# EAGLE design flap_controller (EAGLE 9.7.0)
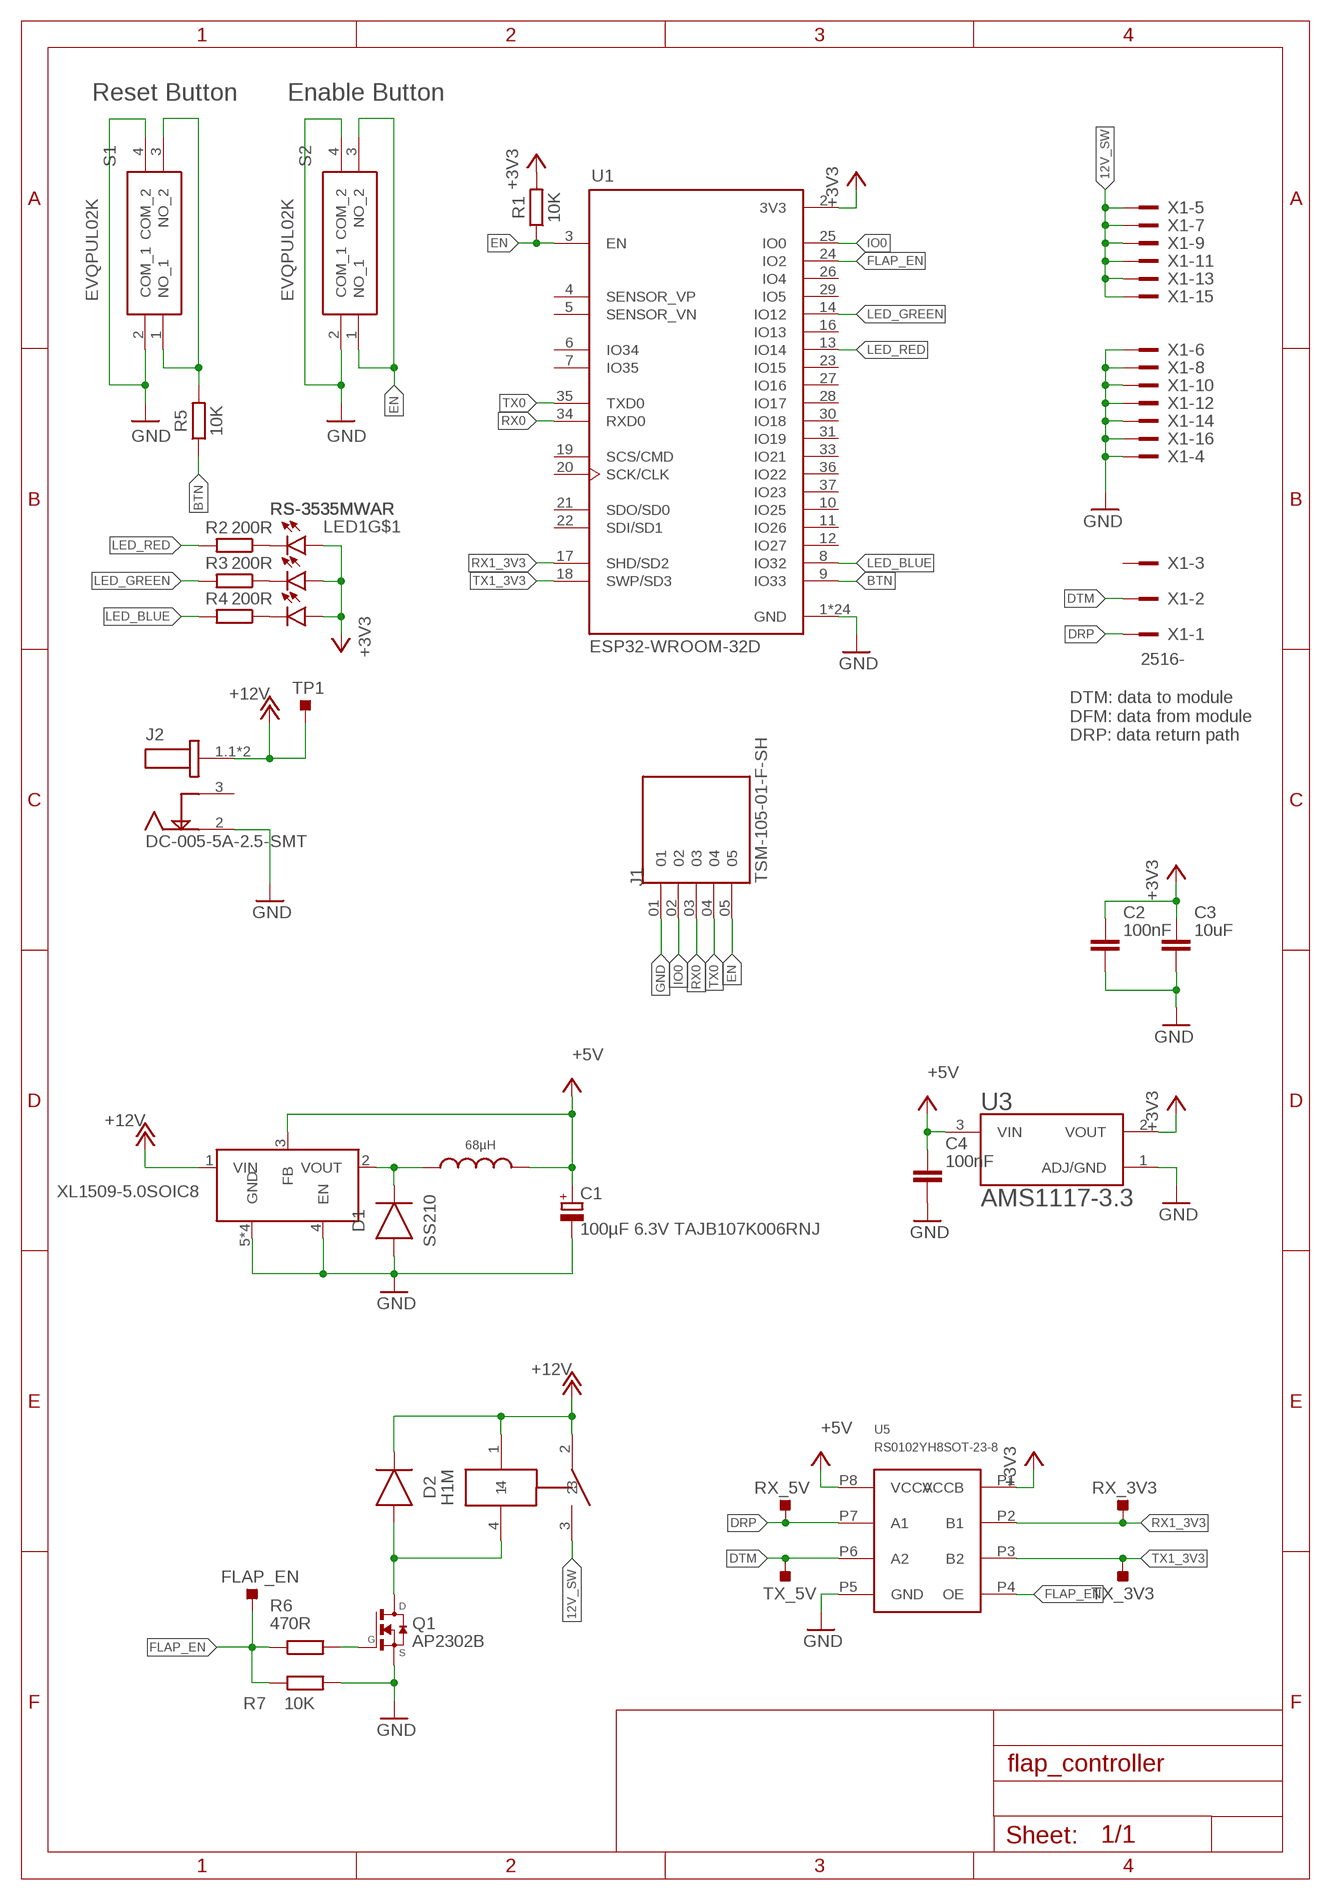
[diagram p0: schematic, sheet 1]

## Parts
C1  100µF 6.3V TAJB107K006RNJ  C-POL_TANTALUM-1411(3528-METRIC)  [CAPMP3528X210N]
C2  100nF  C_CHIP-0805(2012-METRIC)  [CAPC2012X110]
C3  10uF  C_CHIP-0805(2012-METRIC)  [CAPC2012X110]
C4  100nF  C_CHIP-0805(2012-METRIC)  [CAPC2012X110]
D1  SS210  DIODEDO-214AC(SMA)  [DIOM5226X290N]
D2  H1M  DIODE_DO-219-AB(SOD123F)  [SODFL3718X115]
FLAP_EN  TESTPOINT_TPS-PAD-036  [TESTPOINT_PAD-036]
J1  TSM-105-01-F-SH  [SAMTEC_TSM-105-01-F-SH]
J2  DC-005-5A-2.5-SMT  DCJ200-05-A-XX-X_REVA  [GCT_DCJ200-05-A-XX-X_REVA]
K1  G5NB-1A-E DC12  G5NB-1A-EDC12  [G5NB-1A-EDC12]
L1  SWPA6045S680MT  LVS606028-100M-N  [LVS606028-100M-N]
LED1  RS-3535MWAR  [RS-3535MWAR]
Q1  AP2302B  TRANSISTOR-FET_DMN2004K  [TRANSISTOR-FET_SOT23]
R1  10K  R_CHIP-0805(2012-METRIC)  [RESC2012X65]
R2  200R  R_CHIP-0805(2012-METRIC)  [RESC2012X65]
R3  200R  R_CHIP-0805(2012-METRIC)  [RESC2012X65]
R4  200R  R_CHIP-0805(2012-METRIC)  [RESC2012X65]
R5  10K  R_CHIP-0805(2012-METRIC)  [RESC2012X65]
R6  470R  R_CHIP-0805(2012-METRIC)  [RESC2012X65]
R7  10K  R_CHIP-0805(2012-METRIC)  [RESC2012X65]
RX_3V3  TESTPOINT_TPS-PAD-036  [TESTPOINT_PAD-036]
RX_5V  TESTPOINT_TPS-PAD-036  [TESTPOINT_PAD-036]
S1  EVQPUL02K  [EVQPUL02K]
S2  EVQPUL02K  [EVQPUL02K]
TP1  TESTPOINT_TPS-SMD-10SN  [TESTPOINT_SMD-10SN]
TX_3V3  TESTPOINT_TPS-PAD-036  [TESTPOINT_PAD-036]
TX_5V  TESTPOINT_TPS-PAD-036  [TESTPOINT_PAD-036]
U1  ESP32-WROOM-32D  [MODULE_ESP32-WROOM-32D]
U2  XL1509-5.0SOIC8  [SOIC8]
U3  AMS1117-3.3  [SOT229P700X180-4N]
U5  RS0102YH8SOT-23-8  [SOT-23-8]
X1  2516-  [PAK100/2500-16]

## Nets
12V_SW: K1.3 X1.5 X1.7 X1.9 X1.11 X1.13 X1.15
+3V3: C2.1 C3.1 LED1.B_A(A) LED1.G_A(A) LED1.R_A(A) R1.2 U1.2(3V3) U3.2(VOUT) U5.P1(VCCB)
+5V: C1.1(+) C4.1 L1.P$2 U2.3(FB) U3.3(VIN) U5.P8(VCCA)
+12V: D2.1(C) J2.1.1 J2.1.2 K1.1 K1.2 TP1.TP U2.1(VIN)
BTN: R5.1 U1.9(IO33)
DRP: RX_5V.1(TP) U5.P7(A1) X1.1
DTM: TX_5V.1(TP) U5.P6(A2) X1.2
EN: J1.05 R1.1 S2.1(NO_1) S2.3(NO_2) U1.3(EN)
FLAP_EN: FLAP_EN.1(TP) R6.1 R7.1 U1.24(IO2) U5.P4(OE)
GND: C1.2(-) C2.2 C3.2 C4.2 D1.2(A) J1.01 J2.2 Q1.2(S) R7.2 S1.2(COM_1) S1.4(COM_2) S2.2(COM_1) S2.4(COM_2) U1.1(GND) U1.15(GND) U1.38(GND) U1.39_1(GND) U1.39_2(GND) U1.39_3(GND) U1.39_4(GND) U1.39_5(GND) U1.39_6(GND) U1.39_7(GND) U1.39_8(GND) U1.39_9(GND) U1.39_10(GND) U1.39_11(GND) U1.39_12(GND) U1.39_13(GND) U1.39_14(GND) U1.39_15(GND) U1.39_16(GND) U1.39_17(GND) U1.39_18(GND) U1.39_19(GND) U1.39_20(GND) U1.39_21(GND) U2.4(EN) U2.5(GND) U2.6(GND) U2.7(GND) U2.8(GND) U3.1(ADJ/GND) U5.P5(GND) X1.4 X1.6 X1.8 X1.10 X1.12 X1.14 X1.16
IO0: J1.02 U1.25(IO0)
LED_BLUE: R4.2 U1.8(IO32)
LED_GREEN: R3.2 U1.14(IO12)
LED_RED: R2.2 U1.13(IO14)
N$2: D1.1(C) L1.P$1 U2.2(VOUT)
N$3: LED1.B_K(C) R2.1
N$4: LED1.G_K(C) R3.1
N$5: LED1.R_K(C) R4.1
N$7: D2.2(A) K1.4 Q1.3(D)
N$8: Q1.1(G) R6.2
N$22: R5.2 S1.1(NO_1) S1.3(NO_2)
RX0: J1.03 U1.34(RXD0)
RX1_3V3: RX_3V3.1(TP) U1.17(SHD/SD2) U5.P2(B1)
TX0: J1.04 U1.35(TXD0)
TX1_3V3: TX_3V3.1(TP) U1.18(SWP/SD3) U5.P3(B2)
Unconnected: J2.3 U1.4(SENSOR_VP) U1.5(SENSOR_VN) U1.6(IO34) U1.7(IO35) U1.10(IO25) U1.11(IO26) U1.12(IO27) U1.16(IO13) U1.19(SCS/CMD) U1.20(SCK/CLK) U1.21(SDO/SD0) U1.22(SDI/SD1) U1.23(IO15) U1.26(IO4) U1.27(IO16) U1.28(IO17) U1.29(IO5) U1.30(IO18) U1.31(IO19) U1.33(IO21) U1.36(IO22) U1.37(IO23) X1.3

## Notes on the sheet
- Reset Button | Enable Button
- DTM: data to module
  DFM: data from module
  DRP: data return path
- 68µH

## Library data of the parts
C1 = Capacitor:C-POL: Capacitor Polarised - Generic; CATEGORY: Capacitor
C2-C4 = Capacitor:C: Capacitor - Generic; CATEGORY: Capacitor
D1 D2 = Diode:DIODE: Diode Rectifier - Generic; CATEGORY: Diode; SUB-CATEGORY: Rectifier; VALUE: DIODE
FLAP_EN RX_3V3 RX_5V TP1 TX_3V3 TX_5V = 52101-101-REV-A_v16:TESTPOINT_TPS: TEST POINT PAD; BOM: EXCLUDE
J1 = TSM-105-01-F-SH:TSM-105-01-F-SH; MANUFACTURER: Samtec; PARTREV: R; STANDARD: Manufacturer Recommendations
J2 = DCJ200-05-A-XX-X_REVA:DCJ200-05-A-XX-X_REVA: DC Power Jack, SMT, Horizontal, with Locating Pegs, D2.0mm; MANUFACTURER: GCT
K1 = TPMP1470GJ-Z:G5NB-1A-EDC12
L1 = TPMP1470GJ-Z:LVS606028-100M-N
LED1 = TPMP1470GJ-Z:RS-3535MWAR
Q1 = 52101-101-REV-A_v16:TRANSISTOR-FET_DMN2004K: N-Channel Enhancement MOSFET
R1-R7 = Resistor:R: Resistor Fixed - Generic; CATEGORY: Resistor; SUB-CATEGORY: Fixed
S1 S2 = SamacSys_Parts:EVQPUL02K: Black Tactile Switch, Single Pole Single Throw (SPST) 50 mA @ 12 V ac 1.65mm Source: Datasheet <https://www3.panasonic.biz/ac/e_download/control/switch/light-touch/catalog/sw_lt_eng_smalls_side.pdf?f_cd=402910&via=ok>; DESCRIPTION: Black Tactile Switch, Single Pole Single Throw (SPST) 50 mA @ 12 V ac 1.65mm; HEIGHT: 1.95mm; MANUFACTURER_NAME: Panasonic; MANUFACTURER_PART_NUMBER: EVQPUL02K
U1 = ESP32-WROOM-32D:ESP32-WROOM-32D: Bluetooth, WiFi 802.11b/g/n, Bluetooth v4.2 + EDR, Class 1, 2 and 3 Transceiver Module 2.4GHz ~ 2.5GHz Integrated, Trace Surface Mount Check prices <https://pricing.snapeda.com/parts/ESP32-WROOM-32D/Espressif%20Systems/view-part?ref=eda>; AVAILABILITY: Bad; DESCRIPTION: Bluetooth, WiFi 802.11b/g/n, Bluetooth v4.2 +EDR, Class 1, 2 and 3 Transceiver Module 2.4GHz ~ 2.5GHz Integrated, Trace Surface Mount; MF: Espressif Systems; MP: ESP32-WROOM-32D; PACKAGE: Module Espressif Systems; PRICE: None
U2 = TPMP1470GJ-Z:XL1509-5.0
U3 = AMS1117-3.3:AMS1117-3.3: Sot223/Pkg 1-Amp 3.3-Volt Low Drop Out Voltage Regulatator; AVAILABILITY: Unavailable; MANUFACTURER: Advanced Mololithic Systems; MP: AMS1117-3.3; PACKAGE: SOT-223 ams; PARTREV: NA; PRICE: None; STANDARD: IPC-7351B
U5 = TPMP1470GJ-Z:RS0102YH8
X1 = con-3m:2516-: 3M (TM) Pak 100 4-Wall Header Source: 3M; OC_FARNELL: unknown; OC_NEWARK: unknown

## Board
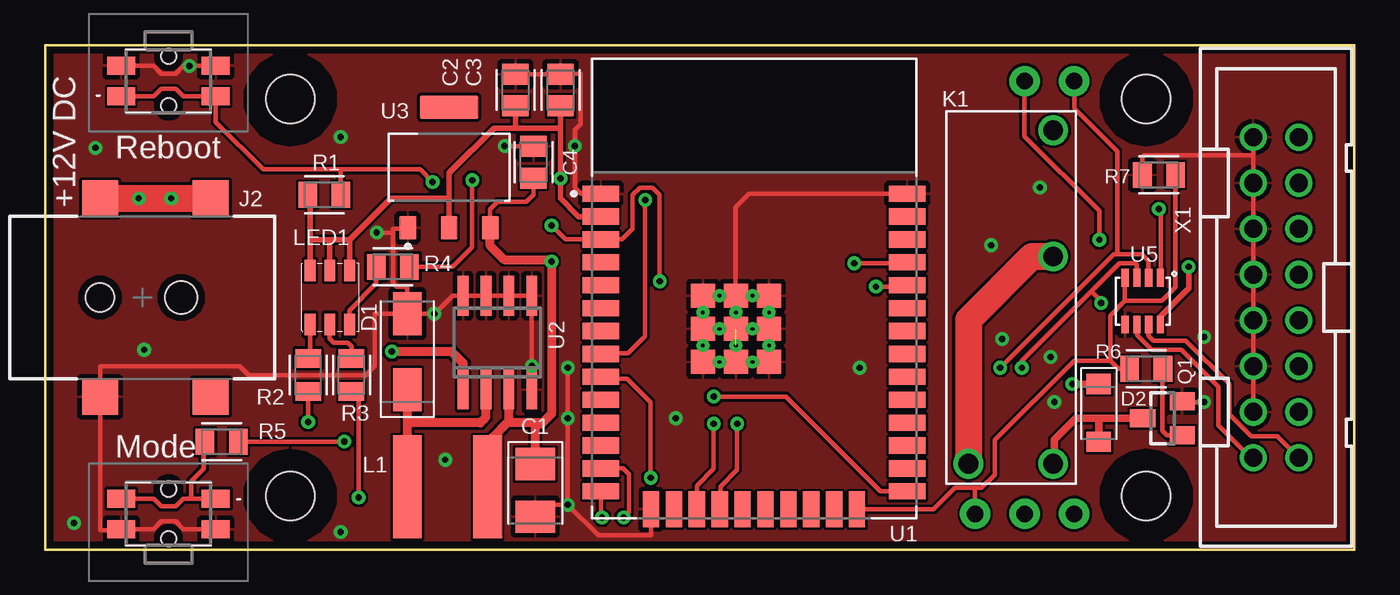
[diagram p1: board, top side]
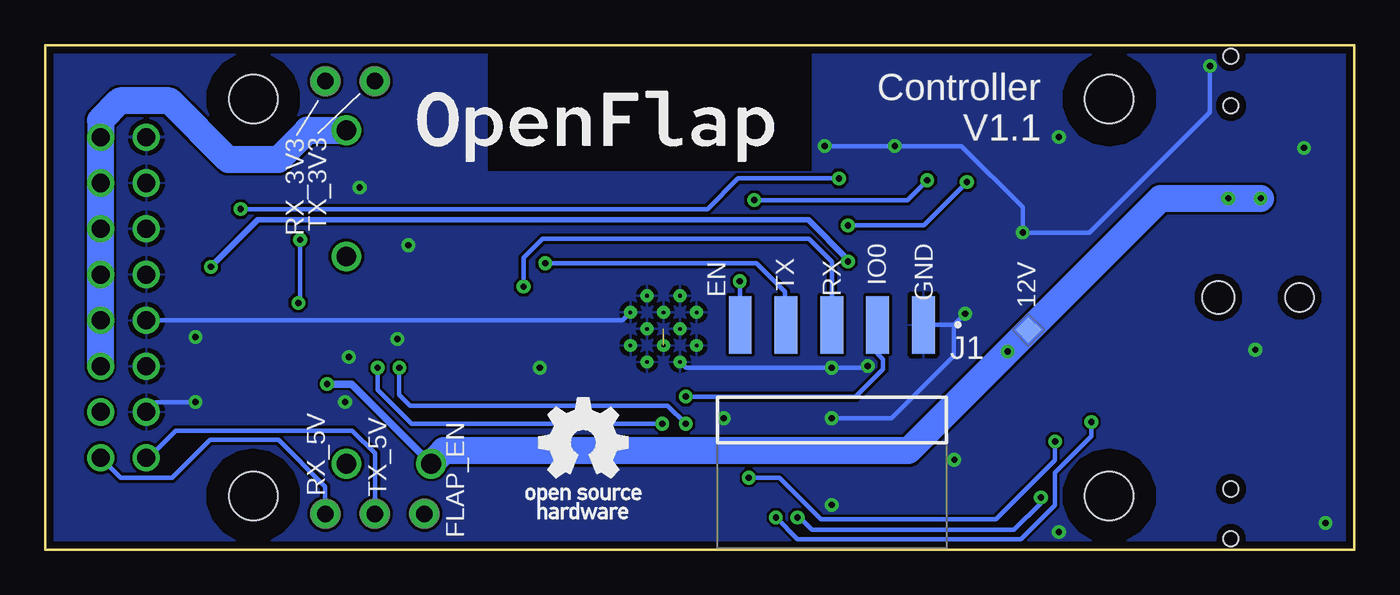
[diagram p2: board, bottom side, seen from below]

Size 72.65 x 28 mm. Coordinates in mm from the lower left corner, seen from the top.
Outline: 0,28 72.65,28 72.65,0 0,0 0,28
Copper layers (1*16): Top / Bottom
Stack-up Default Layer Stack: Top User Defined 0.035mm / Dielectric-1 User Defined 1.5mm / Bottom User Defined 0.035mm
Design rules "default *": minimum track width 6mil, minimum drill 0.35mm, track to track 6mil, track to pad 6mil, pad to pad 6mil, via to via 6mil, smd to smd 6mil, copper to edge 0.4mm, drill to drill 6mil, minimum pad ring 10mil, minimum via ring 8mil, stop-mask expansion 4mil, vias tented up to drill 0mil, thermal gap 10mil
Holes 2.7 mm at 13.6,25 13.6,3 61.1,3 61.1,25
tRestrict: area 11.6,23 to 15.6,27; area 11.6,1 to 15.6,5; area 59.1,1 to 63.1,5; area 59.1,23 to 63.1,27
bRestrict: area 11.6,23 to 15.6,27; area 11.6,1 to 15.6,5; area 59.1,1 to 63.1,5; area 59.1,23 to 63.1,27; area 30.1,21 to 48.1,28.5

### Footprints (pad centres in the part's own frame; a part is rotated, then mirrored left to right if it is on the bottom)
CAPMP3528X210N = smd 1.796 x 2.204: 1 -1.46,0; 2 1.46,0
CAPC2012X110 = smd 1.165 x 1.465: 1 -0.875,0; 2 0.875,0
DIOM5226X290N = smd 2.392 x 1.565: 1 -2.108,0; 2 2.108,0
SODFL3718X115 = smd 1.115 x 1.361: 1 -1.6,0; 2 1.6,0
TESTPOINT_PAD-036 = drill 0.914 pad 1.676: 1 0,0
SAMTEC_TSM-105-01-F-SH = smd 1.27 x 3.18: 01 -5.08,-5.28; 02 -2.54,-5.28; 03 0,-5.28; 04 2.54,-5.28; 05 5.08,-5.28
GCT_DCJ200-05-A-XX-X_REVA = smd 2 x 2: 1.1 -5.5,3.8; 1.2 -5.5,-2.35; 2 5.5,-2.35; 3 5.5,3.8 | hole 1.8: 0,2.15 | hole 1.6: 0,-2.35
G5NB-1A-EDC12 = drill 1.1: 1 -9.222,2.368; 2 2.278,-2.332; 3 9.278,-2.332; 4 -9.222,-2.332
LVS606028-100M-N = smd 5.7 x 1.6: P$1 0,-2.2; P$2 0,2.25
RS-3535MWAR = smd 1.2 x 0.6: B_A -1.5,-1.1; B_K 1.5,-1.1; G_A -1.5,0; G_K 1.5,0; R_A -1.5,1.1; R_K 1.5,1.1
TRANSISTOR-FET_SOT23 = smd 1 x 1.4: 1 -0.95,-1.1; 2 0.95,-1.1; 3 0,1.1
RESC2012X65 = smd 1.031 x 1.42: 1 -0.919,0; 2 0.919,0
EVQPUL02K = smd 1.55 x 1: 1 2.625,0.85; 2 2.625,-0.85; 3 -2.625,0.85; 4 -2.625,-0.85 | hole 0.85: 0,-1.375; 0,1.375
TESTPOINT_SMD-10SN = smd 1 x 1: TP 0,0
MODULE_ESP32-WROOM-32D = smd 2 x 0.9: 1 -8.5,5.26; 2 -8.5,3.99; 3 -8.5,2.72; 4 -8.5,1.45; 5 -8.5,0.18; 6 -8.5,-1.09; 7 -8.5,-2.36; 8 -8.5,-3.63; 9 -8.5,-4.9; 10 -8.5,-6.17; 11 -8.5,-7.44; 12 -8.5,-8.71; 13 -8.5,-9.98; 14 -8.5,-11.25; 25 8.5,-11.25; 26 8.5,-9.98; 27 8.5,-8.71; 28 8.5,-7.44; 29 8.5,-6.17; 30 8.5,-4.9; 31 8.5,-3.63; 32 8.5,-2.36; 33 8.5,-1.09; 34 8.5,0.18; 35 8.5,1.45; 36 8.5,2.72; 37 8.5,3.99; 38 8.5,5.26 | smd 0.9 x 2: 15 -5.715,-12.25; 16 -4.445,-12.25; 17 -3.175,-12.25; 18 -1.905,-12.25; 19 -0.635,-12.25; 20 0.635,-12.25; 21 1.905,-12.25; 22 3.175,-12.25; 23 4.445,-12.25; 24 5.715,-12.25 | smd 1.33 x 1.33: 39_1 -2.835,-0.405; 39_2 -1,-0.405; 39_3 0.835,-0.405; 39_4 -2.835,-2.24; 39_5 -1,-2.24; 39_6 0.835,-2.24; 39_7 -2.835,-4.075; 39_8 -1,-4.075; 39_9 0.835,-4.075 | drill 0.2 pad 0.3: 39_10 -1.917,-0.405; 39_11 -0.083,-0.405; 39_12 -2.835,-1.323; 39_13 -1,-1.323; 39_14 0.835,-1.323; 39_15 -1.917,-2.24; 39_16 -0.083,-2.24; 39_17 -2.835,-3.158; 39_18 -1,-3.158; 39_19 0.835,-3.158; 39_20 -1.917,-4.075; 39_21 -0.083,-4.075
SOIC8 = smd 0.6 x 2.2: 1 -1.905,-2.6; 2 -0.635,-2.6; 3 0.635,-2.6; 4 1.905,-2.6; 5 1.905,2.6; 6 0.635,2.6; 7 -0.635,2.6; 8 -1.905,2.6
SOT229P700X180-4N = smd 0.93 x 1.31: 1 -2.29,-3.345; 2 0,-3.345; 3 2.29,-3.345 | smd 3.24 x 1.31: 4 0,3.345
SOT-23-8 = smd 0.4 x 0.99: P1 -0.975,-1.3; P2 -0.325,-1.3; P3 0.325,-1.3; P4 0.975,-1.3; P5 0.975,1.3; P6 0.325,1.3; P7 -0.325,1.3; P8 -0.975,1.3
PAK100/2500-16 = drill 1 pad 1.422: 1 -8.89,-1.27; 2 -8.89,1.27; 3 -6.35,-1.27; 4 -6.35,1.27; 5 -3.81,-1.27; 6 -3.81,1.27; 7 -1.27,-1.27; 8 -1.27,1.27; 9 1.27,-1.27; 10 1.27,1.27; 11 3.81,-1.27; 12 3.81,1.27; 13 6.35,-1.27; 14 6.35,1.27; 15 8.89,-1.27; 16 8.89,1.27

### Placement (x,y rotation side)
C1  27.2,3.3 270 top
C2  26.1,25.5 90 top
C3  28.6,25.5 90 top
C4  27.1,21.5 90 top
D1  20.1,11 90 top
D2  58.47,7.6 270 top
FLAP_EN  51.6,2 0 bottom
J1  29,7.2 180 bottom
J2  5.4,14 270 top
K1  53.6,14 90 top
L1  22.3,3.5 270 top
LED1  15.8,14 270 top
Q1  62,7.3 90 top
R1  15.5,19.7 180 top
R2  14.6,9.7 270 top
R3  17,9.7 270 top
R4  19.3,15.7 0 top
R5  9.8,6 180 top
R6  61.1,10.05 0 top
R7  61.8,20.8 180 top
RX_3V3  57.1,26 0 bottom
RX_5V  57.1,2 0 bottom
S1  6.85,2 0 top
S2  6.85,26 180 top
TP1  18.08,12.2 315 bottom
TX_3V3  54.35,26 0 bottom
TX_5V  54.35,2 0 bottom
U1  39.34,14.5 0 top
U2  25.1,11.5 0 top
U3  22.41,21.22 0 top
U5  60.9,13.8 180 top
X1  68.3,14 90 top

### Tracks (layer width: path | path; a pad name or v marks a point on that pad's centre or on a via)
12V_SW
  Bottom 1.5: K1.3 58.08,23.28 59.71,21.65 62.49,21.65 65.74,24.9 68.5,24.9 69.57,23.83 X1.15 X1.13 X1.11 X1.9 X1.7 X1.5
+3V3  (via drill 0.35)
  Top 0.254: 30.3,18.49 U1.2 | 28.6,20.4 v28.6,20.6 | v61.8,18.9 61.9,18.8 61.9,15.12 U5.P1
  Top 0.305: 22.41,19.5 U3.2 | 22.41,19.5 22.41,20.91 24.9,23.4 26.1,23.4 | C3.1 28.6,23.4 | v28.6,20.6 28.6,23.4 | 28.6,20.4 28.6,19.5 29.61,18.49 30.3,18.49 | C2.1 26.1,23.4 | 26.1,23.4 28.6,23.4 | 22.41,19.5 19.2,19.5 16.9,17.2 | 16.9,17.2 15.8,17.2 | 15.8,17.2 14.7,17.2 | LED1.G_A 15.8,17.2 | LED1.B_A 14.7,17.2 | LED1.R_A 16.9,17.2 | R1.2 14.7,19.58 14.7,17.2
  Bottom 0.254: v28.6,20.6 34.2,20.6 35.9,18.9 v61.8,18.9
+5V  (via drill 0.35)
  Top 0.254: U3.3 24.7,18.9 25.1,19.3 26.7,19.3 27.1,19.7 C4.1
  Top 0.305: v63.45,15.7 63.45,14.5 61.88,12.93 U5.P8
  Top 0.508: U2.3 25.73,7.13 25.67,7.08 | 25.67,7.08 24.85,6.25 24.85,4.5 | 24.55,4.2 L1.P$2 | 27.2,7.08 C1.1 | 25.67,7.08 27.2,7.08 | 27.2,7.08 27.42,7.08 27.52,6.97 28.1,7.55 v28.1,16 27.99,16.11 25.47,16.11 24.7,16.87 U3.3
  Top 0.813: 24.85,4.5 24.55,4.2
  Bottom 0.305: v28.1,16 28.1,16.1 30.3,18.3 60.85,18.3 v63.45,15.7
+12V  (via drill 0.35)
  Top 0.406: D2.1 v57,9.2 | v57,9.2
  Top 0.508: U2.1 23.2,10.35 22.55,11 v19.25,11
  Top 1.5: K1.1 51.23,12.75 54.76,16.28 K1.2 | J2.1.2 v5.2,19.5 v7,19.5 J2.1.1
  Bottom 0.305: TP1.TP 18.08,12.17 v19.25,11
  Bottom 0.406: v57,9.2 55.65,9.2 K1.1
  Bottom 1.5: K1.1 50.51,5.5 24.75,5.5 v19.25,11 10.75,19.5 v7,19.5 v5.2,19.5
BTN  (via drill 0.35)
  Top 0.254: R5.1 v16.6,6 v16.61,6.01 | U1.9 30.94,9.5 32.3,9.5 33.6,8.2 v33.6,4
  Bottom 0.254: v33.6,4 31.9,4 29.6,1.7 19.9,1.7 16.61,4.98 v16.61,6.01
DRP
  Top 0.254: X1.1 68.38,6.3 66.92,6.3 65.7,7.52 65.7,9.2 63.3,11.6 61.5,11.6 61.23,11.88 U5.P7
  Bottom 0.254: X1.1 68.46,4 65.6,4 63.5,6.1 59.7,6.1 57.1,3.5 RX_5V.1
DTM
  Top 0.254: X1.2 66.89,5.11 65.1,6.9 65.1,9.04 63.04,11.1 61.4,11.1 60.58,11.93 U5.P6
  Bottom 0.254: X1.2 66.89,5.11 65.4,6.6 55.6,6.6 54.35,5.35 TX_5V.1
EN  (via drill 0.35)
  Top 0.254: v28.1,18 28.88,17.22 U1.3 32.02,17.22 32.6,17.8 32.6,19.7 33,20.1 33.7,20.1 34.1,19.7 v34.1,14.9 | 16.4,21.1 12.1,21.1 9.47,23.73 S2.3 7.67,25.15 7.24,25.58 6.46,25.58 6.03,25.15 S2.1 | R1.1 16.4,19.72 16.4,21.1 | 16.4,21.1 20.8,21.1 v21.5,20.4
  Bottom 0.254: v21.5,20.4 23.9,18 v28.1,18 | J1.05 34.08,14.88 v34.1,14.9
FLAP_EN
  Top 0.254: U1.24 49.3,2.25 50.49,3.44 51.6,3.44 | 51.6,3.44 51.96,3.44 52.7,4.18 52.7,6.1 57.1,10.5 59.1,10.5 | U5.P4 59.93,13.82 | 59.93,13.82 59.1,13 59.1,10.5 | R6.1 59.55,10.05 59.1,10.5 | 59.93,13.82 61.98,13.82 62.72,14.57 R7.1 | FLAP_EN.1 51.6,3.44
GND  (via drill 0.35)  (1 unrouted)
  Top 0.254: U3.1 20.05,17.8 19.3,17.8 19.3,17.6 | 19.3,17.6 19.3,14.8 19.5,14.6 20.1,14.6 D1.2 | S2.2 6.03,26.85 6.46,26.42 7.24,26.42 7.67,26.85 v8,26.85 | v8,26.85 S2.4 | v8.01,26.84 v8,26.85 | v18.4,17.6 19.3,17.6 | S1.2 7.67,1.15 7.24,1.58 6.46,1.58 6.03,1.15 S1.4 4.17,1.1 3.1,1.1 3.05,1.15 J2.2 3.05,10.15 3.1,10.2 10.8,10.2 11.3,9.7 17.8,9.7 18.29,10.19 18.29,13.11 D1.2 | U1.15 33.62,0.82 33.6,0.8 30.7,0.8 v29,2.5 | U2.4 v27.01,10.2 U2.5 U2.6 U2.7 U2.8 22.6,14.1 v21.6,13.1 D1.2 | C1.2 27.86,2.5 v29,2.5 | v29,2.5 v29,7.3 v29,10.1 | U1.1 29.74,19.76 29.4,20.1 v29.4,22.4 29.4,23.3 29.7,23.6 29.7,26.4 28.62,26.4 C3.2 C2.2 | C4.2 25.52,22.38 v25.5,22.4 | U1.38 39.06,19.76 38.3,19 38.3,14.13 U1.39_2 | X1.4 X1.6 X1.8 X1.10 X1.12 X1.14 67.03,21.9 | 67.03,21.9 X1.16 | v64.3,8.2 63.15,8.2 Q1.2 | R7.2 60.88,21.78 61,21.9 67.03,21.9
  Bottom 0.254: v8.01,26.84 8.01,24.29 14.7,17.6 v18.4,17.6 18.4,19 21.8,22.4 v25.5,22.4 v29.4,22.4 | v27.01,10.2 27.1,10.1 v29,10.1 37.09,10.1 U1.39_20 | X1.8 40.62,12.73 U1.39_14 | J1.01 22.22,12.48 | 22.22,12.48 v21.6,13.1 | v64.3,8.2 66.48,8.2 X1.4 | v29,7.3 25.7,7.3 22.22,10.78 22.22,12.48
  other vias: 5.5,11.1 22.2,5 1.6,1.5 2.8,22.3 16.4,22.9 35,7.3 45.2,10.1 53.1,11.7 56,8.2 55.8,10.7 64.3,11.8 55.2,20.1 52.5,16.9 16.4,1
  pour Top: -0.4,28.4 -0.4,-0.5 73.4,-0.5 73.4,28.6
  pour Bottom: -0.4,28.5 73.1,28.5 73.1,-0.4 -0.4,-0.4
IO0  (via drill 0.35)
  Top 0.254: v37.1,8.5 41.1,8.5 46.35,3.25 U1.25
  Bottom 0.254: J1.02 26.46,10.88 26.15,10.57 26.15,10.03 27.67,8.5 v37.1,8.5
LED_BLUE  (via drill 0.35)
  Top 0.254: R4.2 22.6,15.7 23.7,16.8 v23.7,20.5 | U1.8 30.88,10.91 32.35,10.91 33.3,11.86 v33.3,19.4
  Bottom 0.254: v23.7,20.5 24.8,19.4 v33.3,19.4
LED_GREEN  (via drill 0.35)
  Top 0.254: v17.4,2.9 17.4,8.38 R3.2 | v30.9,1.8 30.84,1.87 U1.14
  Bottom 0.254: v17.4,2.9 17.4,2.6 18.89,1.11 30.11,1.11 30.8,1.8 v30.9,1.8
LED_RED  (via drill 0.35)
  Top 0.254: U1.13 32.08,4.52 32.4,4.2 32.4,2.1 v32.1,1.8 | v14.6,7.1 R2.2
  Bottom 0.254: v14.6,7.1 14.6,6.3 16.63,4.27 16.63,2.48 18.5,0.6 30.9,0.6 v32.1,1.8
N$2
  Top 0.508: 20.1,7.05 L1.P$1 | 20.1,7.05 24.15,7.05 24.46,7.37 U2.2 | D1.1 20.1,7.05
N$3
  Top 0.254: LED1.B_K 14.7,10.72 R2.1
N$4
  Top 0.254: LED1.G_K 15.8,11.7 16,11.5 16.8,11.5 17,11.3 R3.1
N$5
  Top 0.254: R4.1 18.38,14.78 16.9,13.3 LED1.R_K
N$7
  Top 0.406: K1.4 56,4.85 56,6.1 56.95,7.05 57.2,7.3 58.4,7.3 | 58.4,7.3 Q1.3 | D2.2 58.47,7.23 58.4,7.3
N$8
  Top 0.254: R6.2 62,10.03 62,6.6 62.25,6.35 Q1.1
N$22
  Top 0.254: S1.1 8.1,2.85 | 8.1,2.85 7.67,2.85 7.24,2.42 6.46,2.42 6.03,2.85 S1.3 | R5.2 8.8,5.92 8.8,4.5 8.1,3.8 8.1,2.85
RX0  (via drill 0.35)
  Top 0.254: U1.34 47.76,14.6 v46.1,14.6
  Bottom 0.254: J1.03 29,15.98 30.27,17.25 39.3,17.25 39.35,17.25 45.05,17.25 46.1,16.2 v46.1,14.6
RX1_3V3  (via drill 0.35)
  Top 0.254: U1.17 36.16,3.56 37.1,4.5 v37.1,7 | 59.5,16.4 59.3,16.4 v53,10.1 | 59.5,16.4 59.5,22.1 57.1,24.5 RX_3V3.1 | U5.P2 61.23,16.04 60.87,16.4 59.5,16.4
  Bottom 0.254: v37.1,7 38.1,8 52.4,8 53,8.6 v53,10.1
TX0  (via drill 0.35)
  Top 0.254: U1.35 47.79,15.9 v44.9,15.9
  Bottom 0.254: J1.04 31.6,12.54 31.6,14.32 33.18,15.9 v44.9,15.9
TX1_3V3  (via drill 0.35)
  Top 0.254: U1.18 37.47,2.29 37.47,3.52 38.4,4.45 v38.4,7 | 58.05,14.35 59.6,15.9 60.5,15.9 60.58,15.82 U5.P3 | 58.05,14.35 54.2,10.5 v54.2,10.1 | 58.05,14.35 58.6,13.8 v58.6,13.7 | v58.5,17.2 58.5,18.8 54.35,22.95 TX_3V3.1
  Bottom 0.254: v58.6,13.7 58.5,13.8 v58.5,17.2 | v38.4,7 52.32,7 54.2,8.88 v54.2,10.1

### Text on the board
tPlace: Reboot | +12V DC | Mode
bPlace: GND | IO0 | 12V | RX | TX | EN
tNames: LED1 | L1
bNames: Controller / V1.1